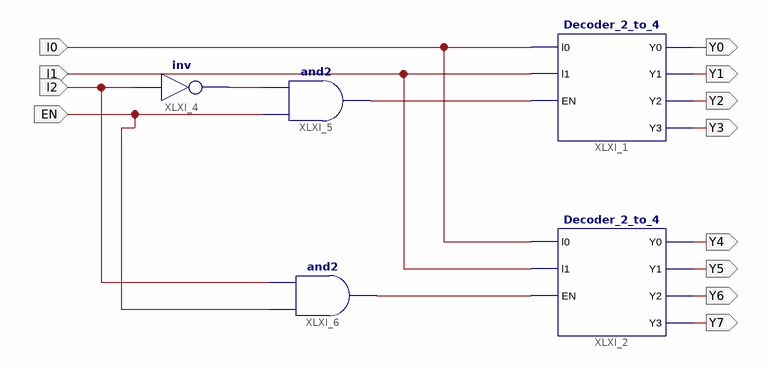
[diagram p0: schematic sheet 1]
// Xilinx ISE schematic Decoder_3_to_8.sch (spartan3e) as structural Verilog: 5 symbols, 12 ports
module Decoder_3_to_8 (
  input  l0,
  input  l1,
  input  l2,
  input  EN,
  output Y0,
  output Y1,
  output Y2,
  output Y4,
  output Y5,
  output Y6,
  output Y7,
  output Y3
);

  wire XLXN_8, XLXN_16, XLXN_17;

  Decoder_2_to_4 XLXI_1 (.EN(XLXN_16), .l0(l0), .l1(l1), .Y0(Y0), .Y1(Y1), .Y2(Y2), .Y3(Y3));
  Decoder_2_to_4 XLXI_2 (.EN(XLXN_17), .l0(l0), .l1(l1), .Y0(Y4), .Y1(Y5), .Y2(Y6), .Y3(Y7));
  not XLXI_4 (XLXN_8, l2);
  and XLXI_5 (XLXN_16, EN, XLXN_8);
  and XLXI_6 (XLXN_17, EN, l2);
endmodule
